# EAGLE design schematic (EAGLE 7.6.0)
CNAME: NixieDriver
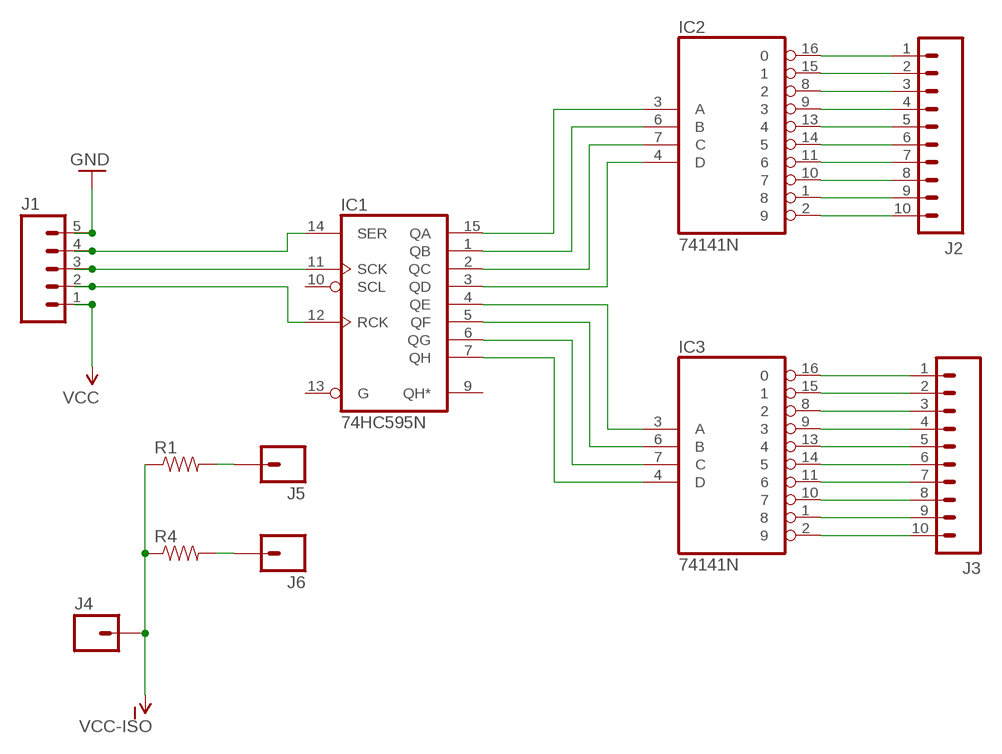
[diagram p0: schematic, sheet 1]

## Parts
IC1  74HC595N  [DIL16]
IC2  74141N  [DIL16]
IC3  74141N  [DIL16]
J1  M05LOCK  [1X05_LOCK]
J2  M10LOCK  [1X10_LOCK]
J3  M10LOCK  [1X10_LOCK]
J4  M01PTH  [1X01]
J5  M01PTH  [1X01]
J6  M01PTH  [1X01]
R1  RESISTORPTH-1/4W  [AXIAL-0.4]
R4  RESISTORPTH-1/4W  [AXIAL-0.4]

## Nets
GND: J1.5
N$1: IC1.15(QA) IC2.3(A)
N$2: IC1.1(QB) IC2.6(B)
N$3: IC1.2(QC) IC2.7(C)
N$4: IC1.3(QD) IC2.4(D)
N$5: IC1.4(QE) IC3.3(A)
N$6: IC1.5(QF) IC3.6(B)
N$7: IC1.6(QG) IC3.7(C)
N$8: IC1.7(QH) IC3.4(D)
N$9: IC2.16 J2.1
N$10: IC2.15 J2.2
N$11: IC2.8 J2.3
N$12: IC2.9 J2.4
N$13: IC2.13 J2.5
N$14: IC2.14 J2.6
N$15: IC2.11 J2.7
N$16: IC2.10 J2.8
N$17: IC2.1 J2.9
N$18: IC2.2 J2.10
N$19: IC3.16 J3.1
N$20: IC3.15 J3.2
N$21: IC3.8 J3.3
N$22: IC3.9 J3.4
N$23: IC3.13 J3.5
N$24: IC3.14 J3.6
N$25: IC3.11 J3.7
N$26: IC3.10 J3.8
N$27: IC3.1 J3.9
N$28: IC3.2 J3.10
N$29: J5.1 R1.P$2
N$30: J6.1 R4.P$2
N$33: IC1.14(SER) J1.4
N$34: IC1.11(SCK) J1.3
N$35: IC1.12(RCK) J1.2
VCC: J1.1
VCC-ISO: J4.1 R1.P$1 R4.P$1
Unconnected: IC1.9(QH*) IC1.10(SCL) IC1.13(G)

## Power pins joined to a net without a drawn wire
GND: IC1.8(GND) IC2.12(GND) IC3.12(GND)
VCC: IC1.16(VCC) IC2.5(VCC) IC3.5(VCC)

## Library data of the parts
IC1 = 74xx-eu:74*595: 8-bit SHIFT REGISTER, output latch
IC2 IC3 = 74xx-us:74*141: BCD to decimal DECODER/DRIVER
J1 = SparkFun-Connectors:M05: Header 5 Standard 5-pin 0.1" header. Use with straight break away headers (SKU : PRT-00116), right angle break away headers (PRT-00553), swiss pins (PRT-00743), machine pins (PRT-00117), and female headers (PRT-00115). Molex polarized connector foot print use with SKU : PRT-08230 with associated crimp pins and housings.
J2 J3 = SparkFun-Connectors:M10: Header 10 Standard 10-pin 0.1" header. Use with straight break away headers (SKU : PRT-00116), right angle break away headers (PRT-00553), swiss pins (PRT-00743), machine pins (PRT-00117), and female headers (PRT-00115).
J4-J6 = SparkFun-Connectors:M01: Header 1 Standard 1-pin 0.1" header. Use with straight break away headers (SKU : PRT-00116), right angle break away headers (PRT-00553), swiss pins (PRT-00743), machine pins (PRT-00117), and female headers (PRT-00115). SMTSO-256-ET is a "flush mount" nut for a 4-40 screw. The older package used to be too tight, and did not allow it to sit properly thru the drill hit. The latest (0.165DIA) fits nice and snug.
R1 R4 = SparkFun-Resistors:RESISTOR: Resistor Basic schematic elements and footprints for 0603, 1206, and PTH resistors.

## Board
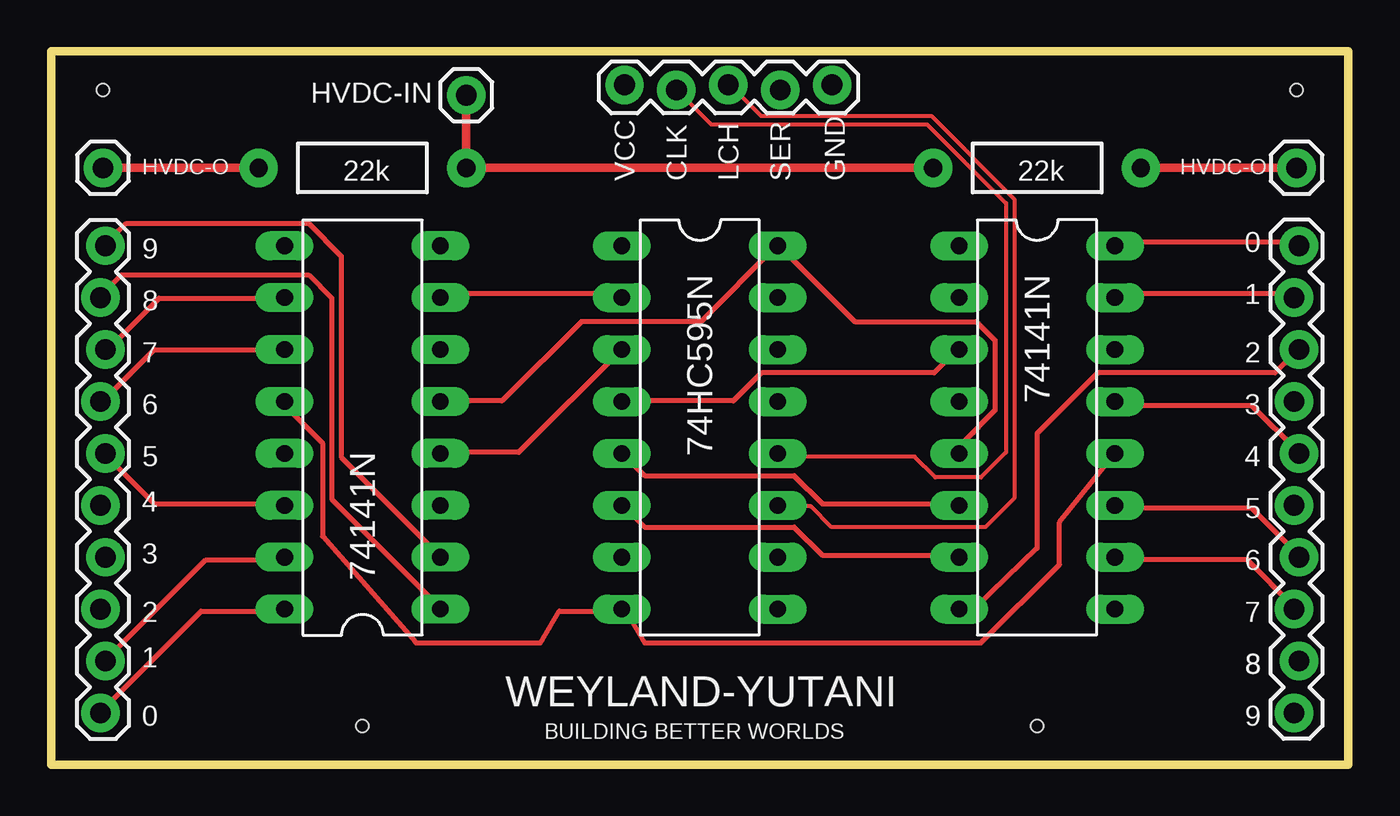
[diagram p1: board, top side]
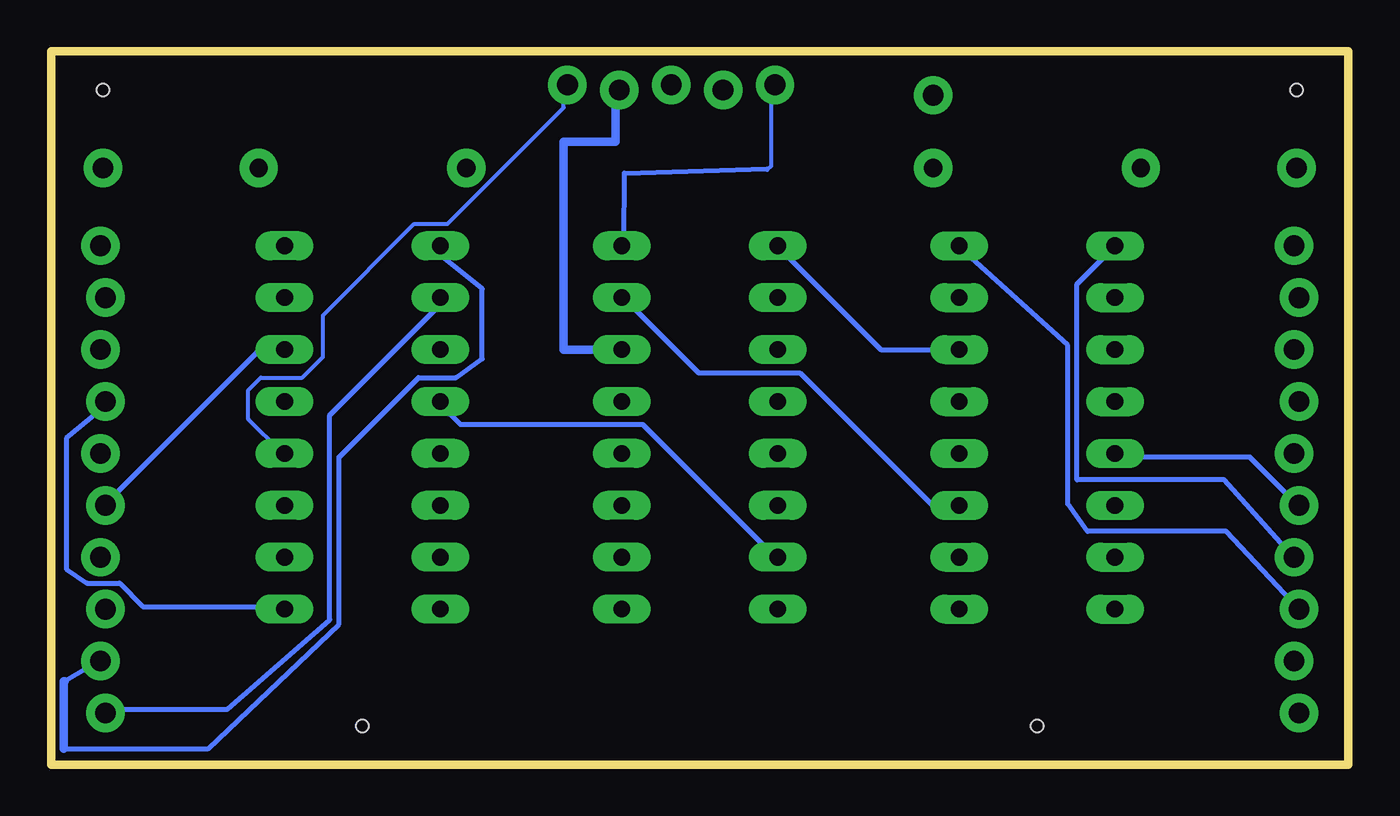
[diagram p2: board, bottom side, seen from below]

Size 63.5 x 34.93 mm. Coordinates in mm from the lower left corner, seen from the top.
Outline: 0,34.93 63.5,34.93 63.5,0 0,0 0,34.93
Copper layers (1*16): Top 0.035mm / dielectric 1.5mm / Bottom 0.035mm
Design rules "SparkFun": minimum track width 8mil, minimum drill 20mil, track to track 8mil, track to pad 8mil, pad to pad 8mil, via to via 8mil, smd to smd 8mil, copper to edge 8mil, drill to drill 8mil, minimum pad ring 12mil, minimum via ring 10mil, stop-mask expansion 4mil, vias tented up to drill 20mil, thermal gap 10mil
Holes 0.6 mm at 48.26,1.9 15.24,1.9 2.54,33.02 60.96,33.02

### Footprints (pad centres in the part's own frame; a part is rotated, then mirrored left to right if it is on the bottom)
DIL16 = drill 0.813 long: 1 -8.89,-3.81; 2 -6.35,-3.81; 3 -3.81,-3.81; 4 -1.27,-3.81; 5 1.27,-3.81; 6 3.81,-3.81; 7 6.35,-3.81; 8 8.89,-3.81; 9 8.89,3.81; 10 6.35,3.81; 11 3.81,3.81; 12 1.27,3.81; 13 -1.27,3.81; 14 -3.81,3.81; 15 -6.35,3.81; 16 -8.89,3.81
1X05_LOCK = drill 1.016 pad 1.88: 1 0,0.127; 2 2.54,-0.127; 3 5.08,0.127; 4 7.62,-0.127; 5 10.16,0.127
1X10_LOCK = drill 1.016 pad 1.88: 1 0,0.127; 2 2.54,-0.127; 3 5.08,0.127; 4 7.62,-0.127; 5 10.16,0.127; 6 12.7,-0.127; 7 15.24,0.127; 8 17.78,-0.127; 9 20.32,0.127; 10 22.86,-0.127
1X01 = drill 1.016 pad 1.88: 1 0,0
AXIAL-0.4 = drill 0.9 pad 1.88: P$1 -5.08,0; P$2 5.08,0

### Placement (x,y rotation side)
IC1  31.75,16.51 270 top
IC2  15.24,16.51 90 top
IC3  48.26,16.51 270 top
J1  28.07,33.15 0 top
J2  2.54,2.54 90 top
J3  60.96,25.4 270 top
J4  20.32,32.77 0 top
J5  2.54,29.21 0 top
J6  60.96,29.21 0 top
R1  15.24,29.21 180 top
R4  48.26,29.21 0 top

### Tracks (layer width: path | path; a pad name or v marks a point on that pad's centre or on a via)
GND
  Top 0.254: IC2.12 11.45,17.58 13.28,15.75 13.28,11.18 17.86,5.97 23.95,5.97 24.87,7.52 27.91,7.52 IC1.8 28.14,7.52 29.06,5.97 45.52,5.97 49.35,9.8 49.35,11.86 51.92,15.06 IC3.12
  Bottom 0.203: J1.5 38.41,33.17 38.41,32.16 44.09,26.47 45.72,26.47 50.19,22 50.19,19.96 51.21,18.95 53.24,18.95 53.85,18.34 53.85,16.92 52.22,15.29 IC3.12
N$1
  Bottom 0.254: IC2.3 19.23,12.78 20.45,12.78 26.85,19.18 31.8,19.18 35.46,22.84 IC1.15
N$2
  Bottom 0.254: IC2.6 22.88,20.32 27.91,25.35 IC1.1
N$3
  Top 0.254: IC2.7 19.23,23.06 27.91,23.06 IC1.2
N$4
  Top 0.254: IC2.4 19.23,15.29 22.88,15.29 27.91,20.32 IC1.3
N$5
  Top 0.254: IC1.4 28.14,17.8 33.4,17.8 34.77,19.18 43.23,19.18 44.37,20.32 IC3.3
N$6
  Top 0.254: IC3.6 44.37,12.78 37.74,12.78 36.37,14.15 29.06,14.15 28.14,15.06 IC1.5
N$7
  Top 0.254: IC3.7 44.37,10.26 37.74,10.26 36.37,11.63 29.06,11.63 28.14,12.55 IC1.6
N$8
  Bottom 0.254: IC1.7 28.14,10.26 34.54,16.66 43.46,16.66 44.37,17.58 IC3.4
N$9
  Top 0.254: IC2.16 11.23,7.52 7.34,7.52 2.54,2.72 J2.1
N$10
  Top 0.254: IC2.15 11.23,10.03 7.57,10.03 2.77,5.23 J2.2
N$11
  Bottom 0.254: J2.3 5.97,11.43 12.78,11.43 13.74,12.78 13.74,20.52 19,25.27 19,25.35 IC2.8
N$12
  Bottom 0.254: J2.4 6.07,13.94 13.28,13.94 13.28,23.52 11.45,25.35 IC2.9
N$13
  Bottom 0.254: IC2.13 11.23,15.06 4.83,15.06 2.54,12.78 J2.5
N$14
  Top 0.254: IC2.14 11.23,12.78 5.05,12.78 2.77,15.06 J2.6
N$15
  Top 0.254: IC2.11 5.05,20.32 2.54,17.8 J2.7
N$16
  Top 0.254: IC2.10 11.23,22.84 5.28,22.84 2.77,20.32 J2.8
N$17
  Top 0.254: IC2.1 19,7.75 13.74,13.01 13.74,22.84 12.6,23.98 3.45,23.98 2.54,23.06 J2.9
N$18
  Top 0.254: IC2.2 19,10.26 14.2,15.06 14.2,24.89 12.6,26.49 3.68,26.49 2.77,25.58 J2.10
N$19
  Top 0.254: IC3.16 52.15,25.58 61.06,25.58 J3.1
N$20
  Top 0.254: IC3.15 52.15,23.06 60.83,23.06 J3.2
N$21
  Top 0.254: IC3.8 45.24,7.75 45.24,7.7 48.26,10.59 48.26,16.2 51.23,19.18 59.92,19.18 61.06,20.32 J3.3
N$22
  Bottom 0.254: IC3.9 52.15,7.75 59,7.75 60.15,8.89 61.75,8.89 62.75,9.58 62.75,15.98 60.83,17.58 J3.4
N$23
  Top 0.254: IC3.13 52.15,17.58 58.78,17.58 61.06,15.29 J3.5
N$24
  Bottom 0.254: IC3.14 53.29,20.32 60.83,12.78 J3.6
N$25
  Top 0.254: IC3.11 52.15,12.55 58.78,12.55 61.06,10.26 J3.7
N$26
  Top 0.254: IC3.10 52.15,10.03 58.55,10.03 60.83,7.75 J3.8
N$27
  Bottom 0.254: 62.88,0.8 55.8,0.8 49.4,6.88 49.4,15.06 45.52,18.95 43.69,18.95 42.39,19.86 42.39,23.29 44.37,24.89 44.37,25.35 IC3.1 | 62.84,4.09 61.29,5 J3.9
  Bottom 0.406: 62.84,4.09 62.88,4.09 62.88,0.8
N$28
  Bottom 0.254: IC3.2 44.6,22.84 44.6,22.38 49.86,17.12 49.86,7.11 54.89,2.72 60.83,2.72 J3.10
N$29
  Top 0.406: J5.1 R1.P$2
N$30
  Top 0.406: R4.P$2 J6.1
N$33
  Bottom 0.406: J1.4 35.88,33.02 35.88,30.48 38.42,30.48 38.42,20.32 IC1.14
N$34
  Top 0.203: IC1.11 35.56,12.65 37.19,12.65 38.2,11.63 45.72,11.63 47.14,13.06 47.14,27.69 43.08,31.75 34.75,31.75 33.33,33.17 J1.3
N$35
  Top 0.203: IC1.12 35.56,15.09 42.27,15.09 43.28,14.07 45.52,14.07 46.74,15.29 46.74,27.48 42.88,31.34 32.31,31.34 30.68,32.97 J1.2
VCC
  Top 0.254: IC3.5 44.6,15.29 44.6,15.75 46.2,17.35 46.2,20.78 45.29,21.69 39.34,21.69 35.69,25.35 IC1.16 35.46,25.35 31.8,21.69 25.96,21.69 22.07,17.8 19.23,17.8 IC2.5
  Bottom 0.203: 28.45,29.16 28.45,29.11 28.24,29.31 28.24,33.17 J1.1
  Bottom 0.254: 28.45,29.16 35.43,28.96 35.46,25.58 IC1.16
VCC-ISO
  Top 0.406: J4.1 R1.P$1 R4.P$1

### Text on the board
tPlace: HVDC-IN | HVDC-O | 22k | VCC | CLK | LCH | SER | GND | 22k | HVDC-O | 9 | 0 | 1 | 8 | 7 | 2 | 6 | 3 | 5 | 4 | 4 | 5 | 3 | 6 | 2 | 7 | 1 | 8 | 8 | WEYLAND-YUTANI | 0 | 9 | BUILDING BETTER WORLDS